# EAGLE board Smoothiepanel (EAGLE 6.3)
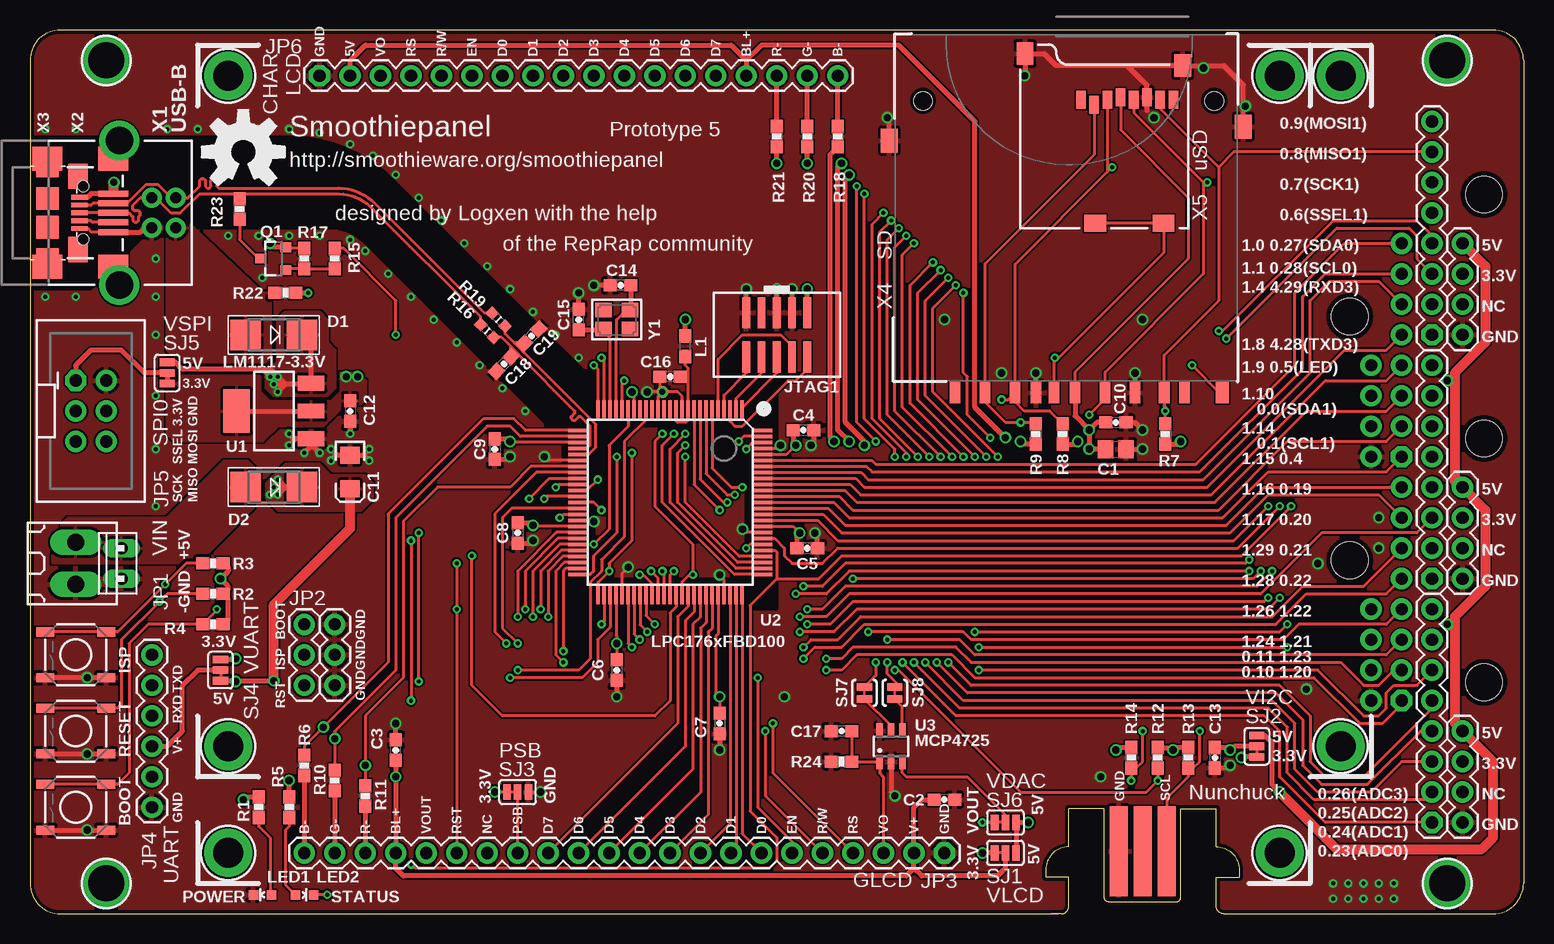
[diagram p2: board, top side]
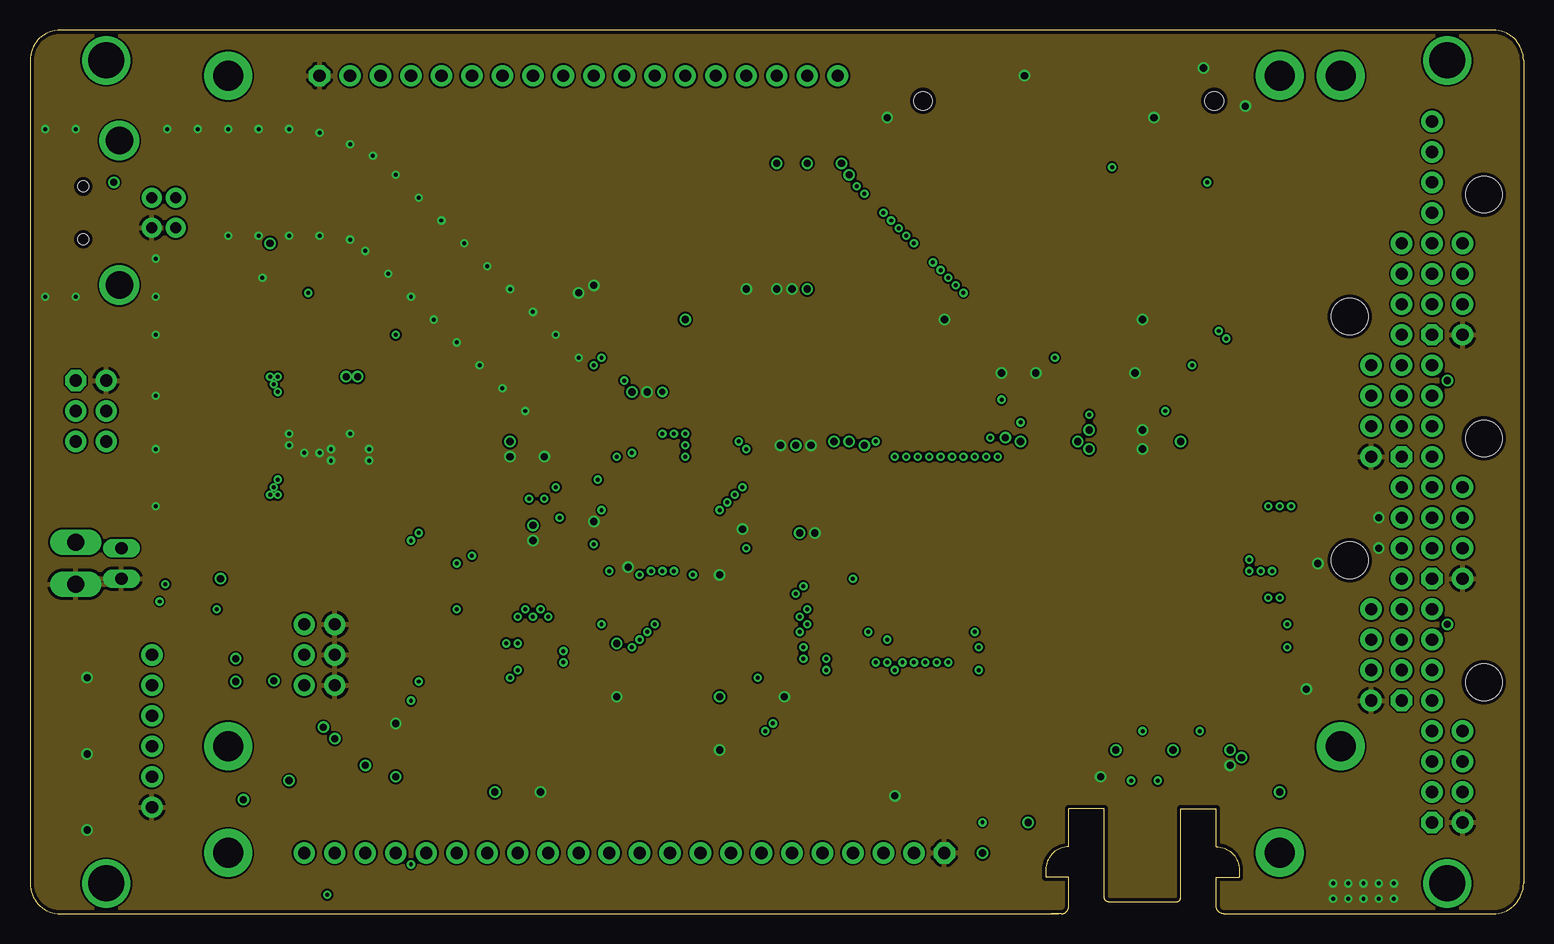
[diagram p3: board, inner layer Route2]
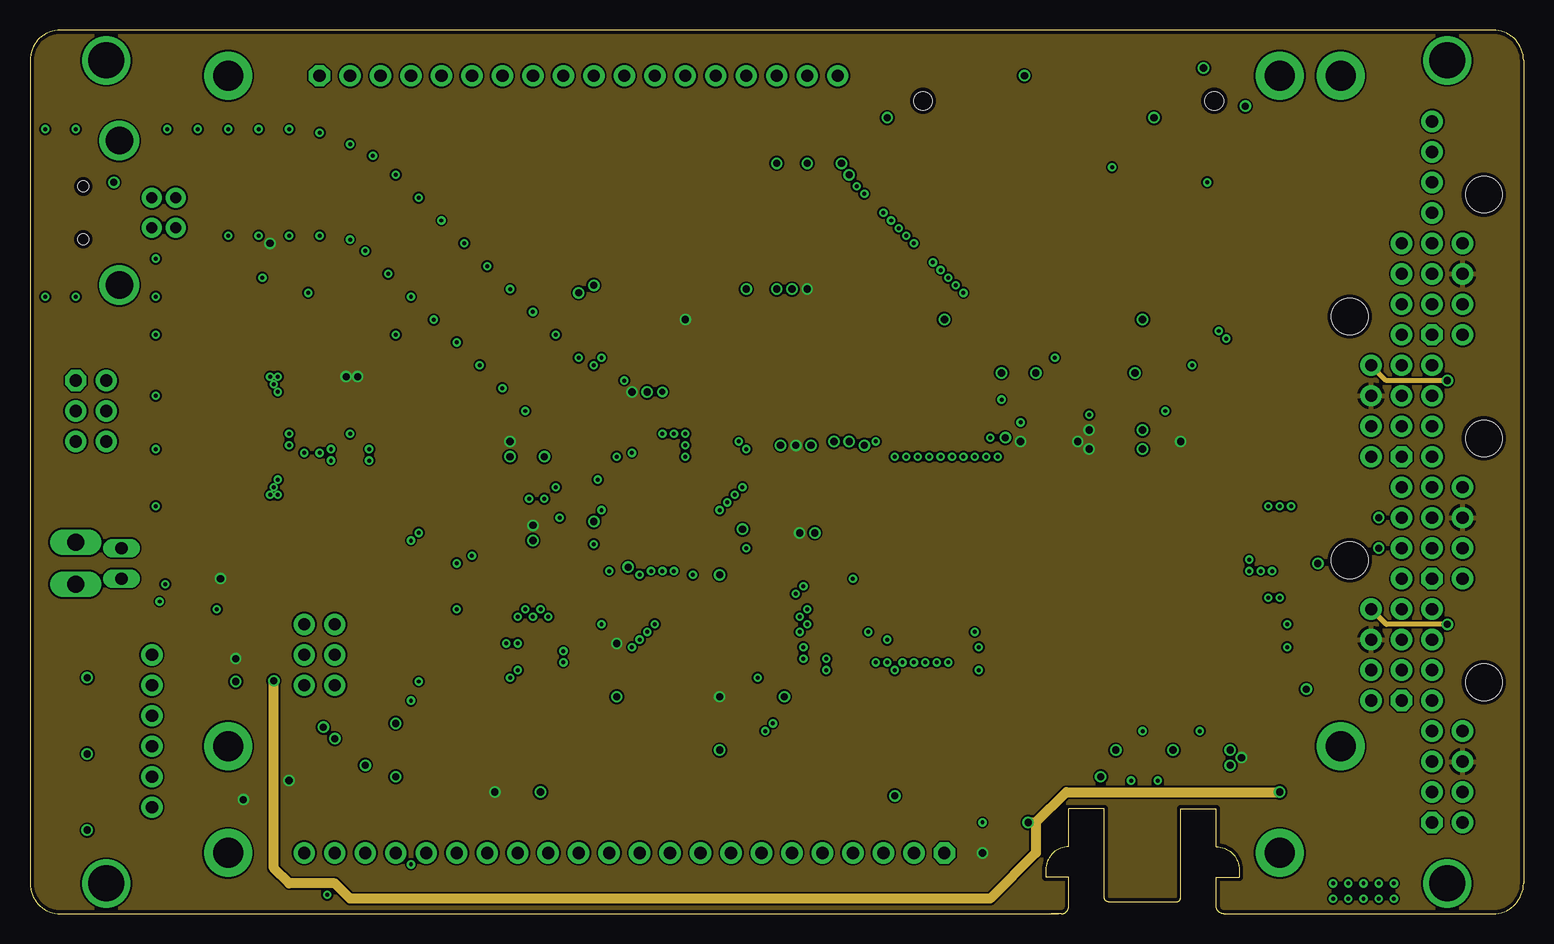
[diagram p4: board, inner layer Route15]
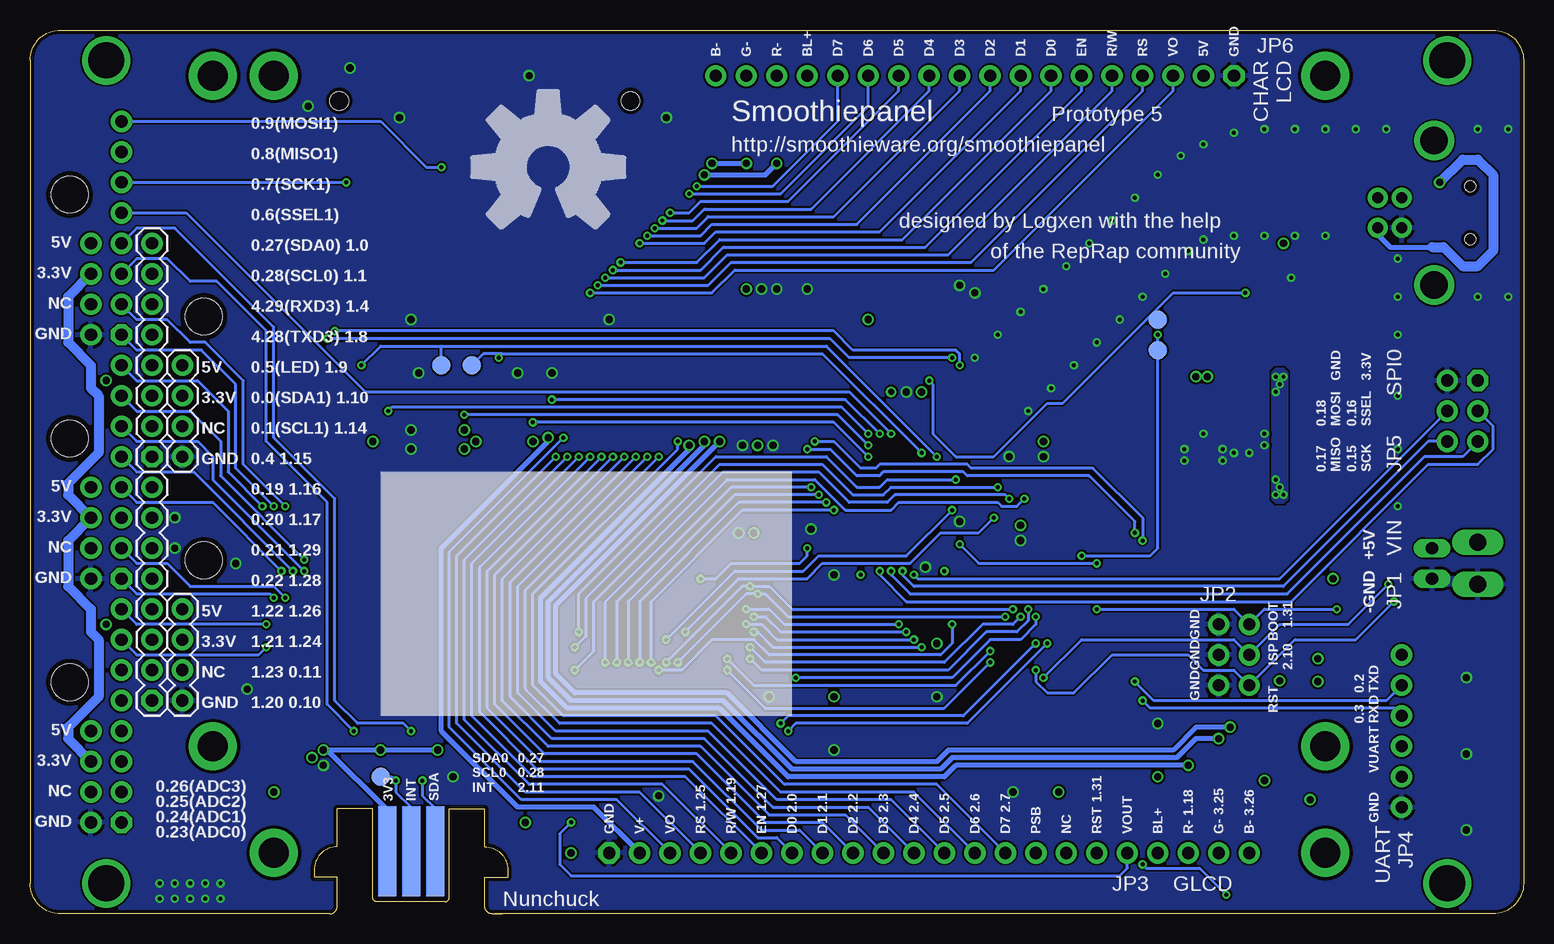
[diagram p5: board, bottom side, seen from below]

Size 124.46 x 73.66 mm. Coordinates in mm from the lower left corner, seen from the top.
Outline: 85.72,0 2.54,0 arc-90 0,2.54 0,71.12 arc-90 2.54,73.66 121.92,73.66 arc-90 124.46,71.12 124.46,2.54 arc-90 121.92,0 99.69,0
Copper layers (1*2*15*16): Top 0.07mm / dielectric 0.2mm / Route2 0.035mm / dielectric 0.99mm / Route15 0.035mm / dielectric 0.2mm / Bottom 0.07mm
Design rules "LaenPCBOrder *": minimum track width 6mil, minimum drill 13mil, track to track 6mil, track to pad 6mil, pad to pad 6mil, via to via 6mil, smd to smd 6mil, copper to edge 12mil, drill to drill 6mil, minimum pad ring 7mil, minimum via ring 7mil, stop-mask expansion 5mil, vias tented up to drill 24mil, thermal gap 10mil

## Footprints (pad centres in the part's own frame; a part is rotated, then mirrored left to right if it is on the bottom)
C0805 = smd 1.3 x 1.5: 1 -0.85,0; 2 0.85,0
0603-CAP = smd 1.1 x 1: 1 -0.85,0; 2 0.85,0
EIA3216 = smd 1.4 x 1.6: A 1.4,0; C -1.4,0
SMADIODE = smd 2.54 x 2.54: A 2.349,0; C -2.349,0
10X02MTA = drill 1.016 long: 1 1.27,0; 2 -1.27,0
1X03 = drill 1.016 pad 1.778: 1 0,0; 2 2.54,0; 3 5.08,0
1X22 = drill 1.016 pad 1.778 octagon: 1 0,0 | drill 1.016 pad 1.778: 2 2.54,0; 3 5.08,0; 4 7.62,0; 5 10.16,0; 6 12.7,0; 7 15.24,0; 8 17.78,0; 9 20.32,0; 10 22.86,0; 11 25.4,0; 12 27.94,0; 13 30.48,0; 14 33.02,0; 15 35.56,0; 16 38.1,0; 17 40.64,0; 18 43.18,0; 19 45.72,0; 20 48.26,0; 21 50.8,0; 22 53.34,0
1X06 = drill 1.016 pad 1.778: 1 0,0; 2 2.54,0; 3 5.08,0; 4 7.62,0; 5 10.16,0; 6 12.7,0
2X3-SHROUDED = drill 1.016 pad 1.778 octagon: 1 -1.27,2.54 | drill 1.016 pad 1.778: 2 1.27,2.54; 3 -1.27,0; 4 1.27,0; 5 -1.27,-2.54; 6 1.27,-2.54
TEXT_LCD = drill 1.016 pad 1.778: A 35.56,0; B 43.18,0; D0 15.24,0; D1 17.78,0; D2 20.32,0; D3 22.86,0; D4 25.4,0; D5 27.94,0; D6 30.48,0; D7 33.02,0; E 12.7,0; G 40.64,0; R 38.1,0; R/W 10.16,0; RS 7.62,0; VDD 2.54,0; VO 5.08,0 | drill 1.016 pad 1.778 octagon: GND 0,0
2X05_1.27MM_SMT = smd 0.65 x 2.6: 1 -2.54,-1.85; 2 -2.54,1.85; 3 -1.27,-1.85; 4 -1.27,1.85; 5 0,-1.85; 6 0,1.85; 7 1.27,-1.85; 8 1.27,1.85; 9 2.54,-1.85; 10 2.54,1.85
0603 = smd 1.1 x 1: 1 -0.85,0; 2 0.85,0
LED-0603 = smd 0.8 x 0.8: A 0,-0.75; C 0,0.75
MOUNTINGHOLE_2.5_PLATED_THICK = drill 2.5 pad 4: P$1 0,0
MOUNTINGHOLE_3.0_PLATEDTHIN = drill 3 pad 3.6: P$1 0,0
NET_LINK = drill 0.5: P$1 0,0 | smd 1.016 x 1.016: P$2 0,0
WII_NUNCHUCK = smd 7.492 x 1.5: 1 5.207,2; 2 5.207,0; 3 5.207,-2 | smd 7.492 x 1.5 bottom: 4 5.207,-2; 5 5.207,0; 6 5.207,2
SOT23-3 = smd 0.8 x 0.9: 1 -0.95,-1; 2 0.95,-1; 3 0,1.1
0603-RES = smd 1.1 x 1: 1 -0.85,0; 2 0.85,0
_0603MP = smd 0.8 x 0.8: 1 -0.762,0; 2 0.762,0
TACTILE_SWITCH_SMD = smd 1.524 x 0.762: 1 -2.54,1.905; 2 2.54,1.905; 3 -2.54,-1.905; 4 2.54,-1.905
SJ_3 = smd 0.635 x 1.27: 1 -0.889,0; 2 0,0; 3 0.889,0
SJ_2S-TRACE = smd 0.635 x 1.27: 1 -0.508,0; 2 0.508,0
TPAD-1.5 = smd 1.524 x 1.524: 1 0,0
SOT223 = smd 1.219 x 2.235: 1 -2.311,-3.099; 2 0,-3.099; 3 2.311,-3.099 | smd 3.6 x 2.2: 4 0,3.099
LQFP100 = smd 0.27 x 1.5: 1 -6,-7.75; 2 -5.5,-7.75; 3 -5,-7.75; 4 -4.5,-7.75; 5 -4,-7.75; 6 -3.5,-7.75; 7 -3,-7.75; 8 -2.5,-7.75; 9 -2,-7.75; 10 -1.5,-7.75; 11 -1,-7.75; 12 -0.5,-7.75; 13 0,-7.75; 14 0.5,-7.75; 15 1,-7.75; 16 1.5,-7.75; 17 2,-7.75; 18 2.5,-7.75; 19 3,-7.75; 20 3.5,-7.75; 21 4,-7.75; 22 4.5,-7.75; 23 5,-7.75; 24 5.5,-7.75; 25 6,-7.75; 51 6,7.75; 52 5.5,7.75; 53 5,7.75; 54 4.5,7.75; 55 4,7.75; 56 3.5,7.75; 57 3,7.75; 58 2.5,7.75; 59 2,7.75; 60 1.5,7.75; 61 1,7.75; 62 0.5,7.75; 63 0,7.75; 64 -0.5,7.75; 65 -1,7.75; 66 -1.5,7.75; 67 -2,7.75; 68 -2.5,7.75; 69 -3,7.75; 70 -3.5,7.75; 71 -4,7.75; 72 -4.5,7.75; 73 -5,7.75; 74 -5.5,7.75; 75 -6,7.75 | smd 1.5 x 0.27: 26 7.75,-6; 27 7.75,-5.5; 28 7.75,-5; 29 7.75,-4.5; 30 7.75,-4; 31 7.75,-3.5; 32 7.75,-3; 33 7.75,-2.5; 34 7.75,-2; 35 7.75,-1.5; 36 7.75,-1; 37 7.75,-0.5; 38 7.75,0; 39 7.75,0.5; 40 7.75,1; 41 7.75,1.5; 42 7.75,2; 43 7.75,2.5; 44 7.75,3; 45 7.75,3.5; 46 7.75,4; 47 7.75,4.5; 48 7.75,5; 49 7.75,5.5; 50 7.75,6; 76 -7.75,6; 77 -7.75,5.5; 78 -7.75,5; 79 -7.75,4.5; 80 -7.75,4; 81 -7.75,3.5; 82 -7.75,3; 83 -7.75,2.5; 84 -7.75,2; 85 -7.75,1.5; 86 -7.75,1; 87 -7.75,0.5; 88 -7.75,0; 89 -7.75,-0.5; 90 -7.75,-1; 91 -7.75,-1.5; 92 -7.75,-2; 93 -7.75,-2.5; 94 -7.75,-3; 95 -7.75,-3.5; 96 -7.75,-4; 97 -7.75,-4.5; 98 -7.75,-5; 99 -7.75,-5.5; 100 -7.75,-6
SOT23-6 = smd 0.55 x 1.2: 1 -0.95,-1.3; 2 0,-1.3; 3 0.95,-1.3; 4 0.95,1.3; 5 0,1.3; 6 -0.95,1.3
PAPILIO-WING-8BITS-F = drill 1.016 pad 1.778 octagon: 1 0,0 | drill 1.016 pad 1.778: 2 0,2.54; 3 0,5.08; 4 0,7.62; 5 0,10.16; 6 0,12.7; 7 0,15.24; 8 0,17.78; 9 2.54,0; 10 2.54,2.54; 11 2.54,5.08; 12 2.54,7.62 | hole 3.048: 4.318,11.684
USB-B-PTH = drill 0.914 pad 1.676: D+ 0,1.25; D- 1.981,1.25; GND 0,-1.25; VBUS 1.981,-1.25 | drill 2.286: S1 -2.718,-6.02; S2 -2.718,6.02
USB-MINIB = smd 2.5 x 0.5: D+ 2.5,0; D- 2.5,0.8; GND 2.5,-1.6; ID 2.5,-0.8; VBUS 2.5,1.6 | smd 2.5 x 2: MTN1 -3,4.5; MTN2 2.5,4.5; MTN3 -3,-4.5; MTN4 2.5,-4.5 | hole 0.9: 0,2.2; 0,-2.2
USB-MICROB-RECEPT = smd 0.4 x 1.35: 1 -1.3,4.125; 2 -0.65,4.125; 3 0,4.125; 4 0.65,4.125; 5 1.3,4.125 | smd 2.1 x 1.6: P$1 3.05,4; P$2 -3.05,4 | smd 1.8 x 1.9: P$3 -3.85,1.45; P$4 3.85,1.45 | smd 1.9 x 1.9: P$5 -1.2,1.45; P$6 1.2,1.45
SDCARD_4UCONN = smd 1.8 x 0.9: 1 -1,6.77; 2 -1,4.27; 3 -1,2.52; 4 -1,-0.73; 5 -1,-3.23; 6 -1,-5.73; 7 -1,-8.15; 8 -1,-9.85; 9 -1,9.27; CD -1,1.02 | smd 2 x 1.4: SH@1 20,14.75; SH@2 21.15,-14.75 | smd 1.8 x 1.1: WP -1,-13 | hole 1.55: 23.3,11.94; 23.3,-12.32
MICRO-SD-SOCKET-PP = smd 0.8 x 1.5: 1 -8.94,10.7; 2 -7.84,10.3; 3 -6.74,10.7; 4 -5.64,10.9; 5 -4.54,10.7; 6 -3.44,10.9; 7 -2.34,10.7; 8 -1.24,10.7 | smd 1.8 x 1.4: CD1 -2.05,0.4; CD2 -7.75,0.4 | smd 1.4 x 1.9: GND1 -13.6,14.55; GND3 -0.45,13.55
CRYSTAL_3.2X2.5 = smd 1.4 x 1.2: 1 -1.1,-0.8; 2 1.1,0.8; GND1 -1.1,0.8; GND2 1.1,-0.8
180-2 = drill 1.422 long: 1 -1.75,0; 2 1.75,0

## Placement (x,y rotation side)
C1  1uF  [C0805]  90.49,38.73 0 top
C2  0.1uF  [0603-CAP]  76.2,9.53 0 top
C3  0.1uF  [0603-CAP]  30.48,13.65 90 top
C4  0.1uF  [0603-CAP]  64.45,40.32 0 top
C5  0.1uF  [0603-CAP]  64.77,30.48 0 top
C6  0.1uF  [0603-CAP]  48.9,20.32 270 top
C7  0.1uF  [0603-CAP]  57.47,15.88 270 top
C8  0.1uF  [0603-CAP]  40.64,31.75 270 top
C9  0.1uF  [0603-CAP]  38.73,38.73 270 top
C10  0.1uF  [0603-CAP]  90.49,40.96 0 top
C11  10uF  [EIA3216]  26.67,36.83 270 top
C12  0.1uF  [0603-CAP]  26.67,41.91 270 top
C13  0.1uF  [0603-CAP]  98.74,13.02 270 top
C14  18pF  [0603-CAP]  49.21,52.39 180 top
C15  18pF  [0603-CAP]  45.72,49.53 90 top
C16  0.1uF  [0603-CAP]  53.34,44.77 180 top
C17  0.1uF  [0603-CAP]  67.63,15.24 180 top
C18  18pF  [0603-CAP]  39.48,45.83 225 top
C19  18pF  [0603-CAP]  41.8,48.15 45 top
D1  MBRA210LT3  [SMADIODE]  20.32,48.26 180 top
D2  MBRA210LT3  [SMADIODE]  20.32,35.56 180 top
JP1  VIN  [10X02MTA]  7.62,29.21 90 top
JP2  SYS  [1X03]  22.86,19.05 90 top
JP3  GLCD  [1X22]  76.2,5.08 180 top
JP4  UART  [1X06]  10.16,8.89 90 top
JP5  SPI0  [2X3-SHROUDED]  5.08,41.91 0 top
JP6  CHAR_LCD  [TEXT_LCD]  24.13,69.85 0 top
JTAG1  JTAG  [2X05_1.27MM_SMT]  62.23,48.26 180 top
L1  FB  [0603]  54.61,47.31 90 top
LED1  POWER  [LED-0603]  19.37,1.59 90 top
LED2  STATUS  [LED-0603]  22.86,1.59 270 top
MH1  MOUNTINGHOLE2.5_THICK  [MOUNTINGHOLE_2.5_PLATED_THICK]  16.51,5.08 0 top
MH2  MOUNTINGHOLE2.5_THICK  [MOUNTINGHOLE_2.5_PLATED_THICK]  104.14,5.08 0 top
MH3  MOUNTINGHOLE2.5_THICK  [MOUNTINGHOLE_2.5_PLATED_THICK]  109.22,13.97 0 top
MH4  MOUNTINGHOLE2.5_THICK  [MOUNTINGHOLE_2.5_PLATED_THICK]  16.51,13.97 0 top
MH5  MOUNTINGHOLE2.5_THICK  [MOUNTINGHOLE_2.5_PLATED_THICK]  109.22,69.85 0 top
MH6  MOUNTINGHOLE2.5_THICK  [MOUNTINGHOLE_2.5_PLATED_THICK]  16.51,69.85 0 top
MH7  MOUNTINGHOLE2.5_THICK  [MOUNTINGHOLE_2.5_PLATED_THICK]  104.14,69.85 0 top
MH8  MOUNTINGHOLE3.0THIN  [MOUNTINGHOLE_3.0_PLATEDTHIN]  118.11,2.54 0 top
MH9  MOUNTINGHOLE3.0THIN  [MOUNTINGHOLE_3.0_PLATEDTHIN]  118.11,71.12 0 top
MH10  MOUNTINGHOLE3.0THIN  [MOUNTINGHOLE_3.0_PLATEDTHIN]  6.35,2.54 0 top
MH11  MOUNTINGHOLE3.0THIN  [MOUNTINGHOLE_3.0_PLATEDTHIN]  6.35,71.12 0 top
N1  NET_LINK  [NET_LINK]  52.7,43.5 90 top
PCB1  WII_NUNCHUCK  [WII_NUNCHUCK]  92.71,0 90 top
Q1  BC857B  [SOT23-3]  20.32,54.61 90 top
R1  330R  [0603-RES]  19.05,8.89 270 top
R2  10K  [0603-RES]  15.24,26.67 0 top
R3  10K  [0603-RES]  15.24,29.21 0 top
R4  10K  [0603-RES]  15.24,24.13 0 top
R5  330R  [0603-RES]  21.59,8.89 270 top
R6  0R  [0603-RES]  22.86,12.38 90 top
R7  10K  [0603-RES]  94.61,40.01 270 top
R8  10K  [0603-RES]  86.04,40.01 270 top
R9  10K  [0603-RES]  83.82,40.01 270 top
R10  0R  [0603-RES]  25.4,11.11 90 top
R11  0R  [0603-RES]  27.94,9.84 90 top
R12  NP  [0603-RES]  93.98,13.02 90 top
R13  10K  [0603-RES]  96.52,13.02 90 top
R14  10K  [0603-RES]  91.76,13.02 90 top
R15  3K  [0603-RES]  25.4,54.61 270 top
R16  33R  [_0603MP]  38.1,48.58 135 top
R17  24K  [0603-RES]  22.86,54.61 90 top
R18  0R  [0603-RES]  67.31,64.77 270 top
R19  33R  [_0603MP]  39.05,49.53 135 top
R20  0R  [0603-RES]  64.77,64.77 270 top
R21  0R  [0603-RES]  62.23,64.77 270 top
R22  100R  [0603-RES]  21.27,51.75 180 top
R23  1.5K  [0603-RES]  17.46,58.74 90 top
R24  NP  [0603-RES]  67.63,12.7 0 top
S1  RESET  [TACTILE_SWITCH_SMD]  3.81,15.24 180 top
S2  ISP  [TACTILE_SWITCH_SMD]  3.81,21.59 180 top
S3  BOOT  [TACTILE_SWITCH_SMD]  3.81,8.89 180 top
SJ1  GLCDV  [SJ_3]  81.28,5.08 180 top
SJ2  VI2C  [SJ_3]  102.23,13.97 270 top
SJ3  PSB  [SJ_3]  40.64,10.16 0 top
SJ4  VUART  [SJ_3]  15.88,20.32 90 top
SJ5  VSPI  [SJ_3]  11.43,45.09 270 top
SJ6  VDAC  [SJ_3]  81.28,7.62 180 top
SJ7  DAC_SCL  [SJ_2S-TRACE]  69.53,18.41 270 top
SJ8  DAC_SDA  [SJ_2S-TRACE]  72.07,18.41 270 top
TP1  TPAD1.5  [TPAD-1.5]  30.48,49.53 0 bottom
TP3  TPAD1.5  [TPAD-1.5]  30.48,46.99 0 bottom
TP4  TPAD1.5  [TPAD-1.5]  95.25,11.43 0 bottom
TP5  TPAD1.5  [TPAD-1.5]  87.63,45.72 0 bottom
TP6  TPAD1.5  [TPAD-1.5]  90.17,45.72 0 bottom
U1  LM1117-3.3V  [SOT223]  20.32,41.91 90 top
U2  LPC176xFBD100  [LQFP100]  53.34,34.29 180 top
U3  MCP4725  [SOT23-6]  71.75,13.97 0 top
U$1  [OSHW-LOGO-HUGE]  81.28,62.23 0 bottom
U$2  [OSHW-LOGO-L]  17.78,63.5 0 top
W1  WING1  [PAPILIO-WING-8BITS-F]  116.84,7.62 0 top
W2  WING2  [PAPILIO-WING-8BITS-F]  116.84,27.94 0 top
W3  WING3  [PAPILIO-WING-8BITS-F]  116.84,48.26 0 top
W4  WING4  [PAPILIO-WING-8BITS-F]  114.3,17.78 0 bottom
W5  WING5  [PAPILIO-WING-8BITS-F]  114.3,38.1 0 bottom
X1  USB-B  [USB-B-PTH]  10.16,58.42 0 top
X2  mUSB  [USB-MINIB]  4.45,58.42 0 top
X3  USB-MICROB-SMDRECEPT  [USB-MICROB-RECEPT]  0,58.42 270 top
X4  SD  [SDCARD_4UCONN]  86.36,44.45 90 top
X5  uSD  [MICRO-SD-SOCKET-PP]  96.52,57.15 0 top
Y1  12MHz  [CRYSTAL_3.2X2.5]  48.9,49.53 0 top
Z1  VIN  [180-2]  3.81,29.21 270 top
Z2  SYS_GND  [1X03]  25.4,19.05 90 top

## Tracks (layer width: path | path; a pad name or v marks a point on that pad's centre or on a via)
3.3V  (via drill 0.6)
  Top 0.254: X5.4 90.88,65.33 96.52,59.69 96.52,54.61 87.09,45.18 X4.4 | R17.2 21.42,55.46 Q1.2 | C7.1 v57.47,18.1 57.15,18.41 57.15,23.18 57.34,23.37 U2.71 | U2.42 42.32,32.29 42.23,32.38 v41.91,32.38 | U2.54 48.84,23.23 48.9,23.18 v48.9,22.54 C6.1 | U2.96 63.05,38.29 v63.82,39.05 | U2.84 63.59,32.29 v64.14,31.75 | U2.19 50.34,43.32 v50.16,43.5 | SJ3.1 v38.73,10.16 | U2.28 40.09,39.29 v40.01,39.37 | C10.1
  Top 0.406: U1.4 U1.2 | C12.1 27.09,42.76 | SJ4.3 17.08,21.21 v17.14,21.27 | L1.2 v54.61,49.53 | JTAG1.1 v64.77,52.07 | R7.2 95.67,39.16 v95.89,39.37 | C1.1 v88.27,38.73 v88.27,40.32 | C10.1 88.9,40.96 v88.27,40.32 | R9.2 82.77,39.16 v82.55,39.37 | R8.2 87.1,39.16 v87.31,39.37 | R1.1 18,9.74 v17.78,9.53 | R5.1 v21.59,11.11 | C8.1 41.7,32.6 v41.91,32.38 | C9.1 39.79,39.59 v40.01,39.37 | C4.1 63.6,39.27 v63.82,39.05 | C5.1 63.92,31.54 v64.14,31.75 | SJ1.3 v79.38,5.08 | X4.4 87.09,41.5 v88.27,40.32 | Q1.2 20.32,55.56 v20,55.88 | R4.2 16.19,24.13 16.51,24.45 16.51,26.25 R2.2 16.19,26.67 16.51,26.99 16.51,27.3 v15.88,27.94 16.51,28.57 16.51,28.89 16.19,29.21 R3.2 | SJ2.3 101.03,13.08 v100.97,13.02
  Bottom 0.813: W3.11 121.28,51.44 121.28,47.62 119.38,45.72 119.38,43.81 118.75,43.18 118.75,38.42 121.28,35.88 121.28,34.92 W2.11 121.28,31.11 121.28,27.3 119.38,25.4 119.38,23.5 118.75,22.86 118.75,18.1 121.28,15.56 121.28,14.61 W1.11
  other vias: 26.35,44.77 27.3,44.77
  pour Top (isolate 0.254, rank 2): 11.43,40.01 11.43,44.45 12.06,45.09 27.3,45.09 27.94,44.45 27.94,42.86 27.3,42.23 26.04,42.23 24.45,40.64 20.64,40.64 19.37,39.37 12.06,39.37
  pour Route15: -5.08,78.74 129.54,78.74 129.54,-5.08 -5.08,-5.08
5V  (via drill 0.33, 0.6)
  Top 0.406: D1.C 23.42,47.51 U1.3 22.95,44.22 22.86,44.13 21.27,44.13 | D2.C 21.27,35.56 | 21.27,35.56 v20.64,36.2 | 21.27,35.56 v20.64,34.92 | 21.27,35.56 v20.32,35.56 | 21.27,44.13 v20.64,44.77 20,45.4 19.37,45.4 | 21.27,44.13 v20.64,43.5 | 21.27,44.13 v20.32,44.13 | SJ4.1 17.08,19.43 | 17.08,19.43 v17.14,19.37 | 17.08,19.43 v20.32,19.43 | SJ1.1 SJ6.1 v83.19,7.62 | 118.75,45.09 v118.11,44.45 118.75,43.81 | 118.75,24.77 v118.11,24.13 118.75,23.5 | v104.14,10.16 103.5,10.79 103.5,14.29 102.93,14.86 SJ2.1 | v20,44.77 19.37,45.4 | 19.37,45.4 12.7,45.4 12.13,45.97 SJ5.1
  Top 0.813: W3.12 121.28,53.98 121.28,47.62 118.75,45.09 118.75,43.81 118.75,36.2 | W2.12 121.28,33.66 121.28,27.3 118.75,24.77 118.75,23.5 118.75,15.88 W1.12 121.92,12.7 121.92,6.35 120.97,5.4 108.9,5.4 v104.14,10.16 | C11.A 26.67,32.13 20.32,25.78 v20.32,19.43
  Top 1.016: 118.75,36.2 W2.12
  Route15 0.406: v118.11,44.45 113.03,44.45 W5.12 | v118.11,24.13 113.03,24.13 W4.12
  Route15 0.813: v83.19,7.62 83.82,7.62 | 83.82,7.62 86.36,10.16 v104.14,10.16 | 83.82,7.62 83.82,5.08 80.01,1.27 26.67,1.27 25.4,2.54 21.59,2.54 20.32,3.81 v20.32,19.43
  Bottom 0.406: 20.32,44.45 v20.32,44.13
  other vias: 20,34.92
  pour Top (isolate 0.254): 21.27,50.16 24.13,50.16 24.77,49.53 24.77,47.62 25.4,46.99 25.4,43.81 24.77,43.18 20.32,43.18 19.68,43.81 19.68,45.09 20.64,46.04 20.64,49.53
  pour Top (isolate 0.254): 20.64,33.66 27.62,33.66 28.57,34.61 28.57,35.88 27.94,36.51 25.08,36.51 24.13,37.47 21.27,37.47 19.68,35.88 19.68,34.61
  pour Bottom (isolate 0.254): 20,45.4 20.64,45.4 20.95,45.09 20.95,34.61 20.64,34.29 20,34.29 19.68,34.61 19.68,45.09
!TRST!
  Top 0.254: U2.4 57.84,43.23 59.69,45.09 JTAG1.10
ADC0  (via drill 0.33)
  Top 0.254: U2.9 55.34,35.78 v57.47,33.66 | W1.1 107.95,7.62 104.14,11.43 104.14,15.24 102.87,16.51 77.15,16.51 v72.71,20.95
  Bottom 0.254: v57.47,33.66 65.09,33.66 72.71,26.04 v72.71,20.95
ADC1  (via drill 0.33)
  Top 0.254: U2.8 55.84,36.23 57.78,34.29 v58.1,34.29 | v73.66,20.95 77.47,17.14 103.19,17.14 104.78,15.56 104.78,11.75 107,9.53 116.2,9.53 W1.2
  Bottom 0.254: v58.1,34.29 65.41,34.29 73.66,26.04 v73.66,20.95
ADC2  (via drill 0.33)
  Top 0.254: U2.7 56.34,36.69 58.1,34.92 v58.74,34.92 | W1.3 114.3,12.7 111.76,10.16 107.31,10.16 105.41,12.06 105.41,15.88 103.5,17.78 77.79,17.78 v74.61,20.95
  Bottom 0.254: v58.74,34.92 65.72,34.92 74.61,26.04 v74.61,20.95
ADC3  (via drill 0.33)
  Top 0.254: U2.6 56.84,37.14 58.42,35.56 v59.37,35.56 | v75.56,20.95 78.11,18.41 103.82,18.41 106.05,16.19 106.05,12.38 107.63,10.79 111.44,10.79 115.89,15.24 W1.4
  Bottom 0.254: v59.37,35.56 66.04,35.56 75.56,26.04 v75.56,20.95
AGND
  Top 0.254: U2.15 52.34,43.13 N1.P$1 | U2.11 54.34,43.13 53.98,43.5 N1.P$1 | C16.2 52.49,43.71 N1.P$1
AVCC
  Top 0.254: 54.84,44.77 U2.10 54.84,41.19 54.61,40.96 53.98,40.96 53.84,41.09 U2.12 | 54.84,44.77 54.84,45.49 54.61,45.72 L1.1 | C16.1 54.84,44.77
DAC_SCL_RES
  Top 0.254: U3.5 71.75,15.68 SJ7.2
DAC_SDA_RES
  Top 0.254: U3.4 72.7,17.27 SJ8.2
DAC_VIN
  Top 0.254: U3.3 72.71,11.75 73.03,11.43 78.11,11.43 81.28,8.26 SJ6.2 79.06,7.62
DM
  Top 0.254: R19.2 37.88,50.07 28.73,59.21 arc44 25.72,60.48 15.72,60.48 15.56,60.64 15.56,61.12 15.4,61.28 15.24,61.28 15.08,61.12 15.08,60.64 14.92,60.48 14.76,60.48 14.61,60.64 14.61,61.12 14.45,61.28 14.29,61.28 14.13,61.12 14.13,60.64 13.16,59.67 X1.D- 11.77,59.67 10.64,60.8 9.68,60.8 8.1,59.22 X2.D- 5.25,59.22 5.08,59.05 4.14,59.05 X3.2
DP
  Top 0.254: R16.2 37.56,49.75 28.57,58.74 arc50 25.4,60.01 17.46,60.01 | 17.46,60.01 14.13,60.01 12.54,58.42 11.75,58.42 10.5,59.67 X1.D+ 9.19,59.67 8.57,59.05 8.57,58.74 8.73,58.58 9.05,58.58 9.21,58.42 9.21,58.26 9.05,58.1 9.05,57.78 8.89,57.63 8.73,57.63 8.57,57.78 8.57,58.1 8.26,58.42 X2.D+ X3.3 | R23.2 17.46,60.01
GND  (via drill 0.33, 0.6)
  Top 0.254: X3.5 4.79,57.12 5.09,56.82 X2.GND | U2.97 62.28,38.79 v62.55,39.05 | U2.72 57.84,27.89 v57.47,28.26 | U2.83 59.65,31.79 v59.37,32.07 | N1.P$2 v51.44,43.5 | U2.41 46.9,32.79 v46.99,32.7 | U2.31 43.17,37.79 v42.86,38.1 | SJ3.3 v42.55,10.16 | U2.55 49.34,28.39 v49.85,28.89
  Top 0.406: U1.1 22,39.6 | 22,39.6 v21.59,40.01 | 22,39.6 22,39.46 v21.59,39.05 | U1.1 23.42,38.98 v22.86,38.42 | U1.1 23.42,39.13 v24.13,38.42 | 25.53,38.23 C11.C 27.81,38.23 | 25.53,38.23 v25.08,37.78 | 25.53,38.23 25.53,38.29 v25.08,38.73 | 27.81,38.23 v28.26,37.78 | 27.81,38.23 27.81,38.29 v28.26,38.73 | C12.2 v26.67,40.01 | X5.GND3 91.44,70.7 | 91.44,70.7 85.51,70.7 84.51,71.7 X5.GND1 82.92,69.9 v82.87,69.85 | 91.44,70.7 93.08,69.06 X5.6 93.08,66.94 | X5.GND3 99.48,70.7 101.11,69.07 X4.SH@2 101.11,67.14 v101.28,67.31 | X2.GND 9.2,56.82 9.53,57.15 10.14,57.15 X1.GND | C7.2 v57.47,13.65 | C6.2 v48.9,18.1 | C15.2 v45.72,51.75 | C14.2 v46.99,52.39 | JTAG1.9 v59.69,52.07 | JTAG1.5 v62.23,52.07 | JTAG1.3 v63.5,52.07 | X4.6 92.09,45.07 v92.08,45.09 | C13.2 99.8,12.17 v100.01,12.38 | C10.2 92.08,40.96 v92.71,40.32 | C1.2 v92.71,38.73 | C8.2 41.7,30.9 v41.91,31.11 | C9.2 39.79,37.88 v40.01,38.1 | C4.2 65.3,39.27 v65.09,39.05 | C5.2 65.62,31.54 v65.41,31.75 | X4.3 83.82,43.47 v83.82,45.09 | X4.SH@1 71.61,66.19 v71.44,66.36 | X5.GND3 97.58,70.7 v97.79,70.48 | C3.2 v30.48,15.88 | U3.2 71.75,10.16 v72.07,9.84 | S1.2 v4.76,13.34 S1.1 | S2.1 v4.76,19.68 S2.2 | S3.2 v4.76,6.99 S3.1
  other vias: 19.05,56.52 21.59,65.41 24.13,56.52 19.05,65.41 16.51,65.41 11.43,65.41 13.97,65.41 10.48,54.61 93.66,66.36 92.71,49.53 80.96,45.09 89.22,11.43 107.31,29.21 106.36,18.73 112.39,30.48 62.87,18.1 24.13,65.09 26.67,64.14 21.59,56.52 26.67,56.2 30.48,61.59 29.84,53.34 34.29,57.78 28.57,63.18 32.38,59.69 27.94,55.24 36.2,55.88 31.75,51.44 38.1,53.98 40.01,52.07 41.91,50.16 43.81,48.26 33.66,49.53 35.56,47.62 39.37,43.81 45.72,46.35 41.27,41.91 37.47,45.72 16.51,56.52 10.48,51.44 10.48,48.26 19.37,53.02 3.81,65.41 1.27,65.41 1.27,51.44 3.81,51.44 109.86,1.27 108.58,1.27 108.58,2.54 109.86,2.54 111.12,2.54 112.39,2.54 113.67,2.54 113.67,1.27 112.39,1.27 111.12,1.27 112.39,33.02 10.48,43.18 10.48,38.73 10.48,33.97 76.2,49.53
  pour Top (rank 6): -2.54,76.2 127,76.2 127,-2.54 -2.54,-2.54
  pour Bottom (rank 6): -1.27,74.93 125.73,74.93 125.73,-1.27 -1.27,-1.27
  pour Route2: -3.81,77.47 128.27,77.47 128.27,-3.81 -3.81,-3.81
INT  (via drill 0.33)
  Top 0.254: U2.52 47.84,24.34 v47.62,24.13 | R12.1 v93.98,11.11 93.03,10.16 82.55,10.16 72.39,20.32 v72.07,20.32
  Bottom 0.254: PCB1.5 92.71,8.89 93.98,10.16 v93.98,11.11 94.3,11.43 TP4.1 | v47.62,24.13 47.62,22.54 48.58,21.59 62.87,21.59 64.14,22.86 67.63,22.86 70.17,20.32 v72.07,20.32
ISP  (via drill 0.33)
  Top 0.254: U2.53 48.34,23.89 47.31,22.86 47.31,20.95 46.04,19.68 v40.01,19.68 | S2.4 S2.3 7.3,23.5 v11.27,27.46 13.02,29.21 R3.1
  Bottom 0.254: v40.01,19.68 36.83,22.86 24.13,22.86 JP2.2 20.32,24.13 14.61,24.13 v11.27,27.46
LCD_D0  (via drill 0.33)
  Top 0.254: U2.75 59.34,6.7 JP3.7 | v77.79,38.1 73.34,42.55 73.34,52.39 v75.25,54.29
  Bottom 0.254: JP3.7 62.23,6.35 63.82,6.35 69.53,12.06 82.23,12.06 87,16.83 87,28.89 v77.79,38.1 | v75.25,54.29 68.9,54.29 66.99,56.2 51.75,56.2 39.37,68.58 JP6.D0
LCD_D1  (via drill 0.33)
  Top 0.254: U2.74 58.84,5.5 JP3.8 | v76.83,38.1 72.71,42.23 72.71,54.93 v73.66,55.88
  Bottom 0.254: JP3.8 60.33,6.99 63.5,6.99 69.22,12.7 81.92,12.7 86.36,17.14 86.36,28.57 v76.83,38.1 | v73.66,55.88 68.26,55.88 67.31,56.83 53.66,56.83 41.91,68.58 JP6.D1
LCD_D2  (via drill 0.33)
  Top 0.254: U2.73 58.34,7.54 JP3.9 | v75.88,38.1 72.07,41.91 72.07,55.56 v73.03,56.52
  Bottom 0.254: JP3.9 58.42,7.62 63.18,7.62 68.9,13.34 81.6,13.34 85.72,17.46 85.72,28.26 v75.88,38.1 | v73.03,56.52 68.58,56.52 67.63,57.47 55.56,57.47 44.45,68.58 JP6.D2
LCD_D3  (via drill 0.33)
  Top 0.254: U2.70 56.84,23.82 56.52,23.5 56.52,8.26 JP3.10 | v74.93,38.1 71.44,41.59 71.44,56.2 v72.39,57.15
  Bottom 0.254: JP3.10 56.52,8.26 62.87,8.26 68.58,13.97 81.28,13.97 85.09,17.78 85.09,27.94 v74.93,38.1 | v72.39,57.15 68.9,57.15 67.94,58.1 57.47,58.1 46.99,68.58 JP6.D3
LCD_D4  (via drill 0.33)
  Top 0.254: U2.69 56.34,24.27 55.88,23.81 55.88,10.16 JP3.11 | v73.98,38.1 70.8,41.27 70.8,56.83 v71.75,57.78
  Bottom 0.254: JP3.11 54.61,8.89 62.55,8.89 68.26,14.61 80.96,14.61 84.45,18.1 84.45,27.62 v73.98,38.1 | v71.75,57.78 69.22,57.78 68.26,58.74 59.37,58.74 49.53,68.58 JP6.D4
LCD_D5  (via drill 0.33)
  Top 0.254: U2.68 55.84,24.73 55.24,24.13 55.24,12.06 JP3.12 | v73.03,38.1 73.03,38.42 70.17,41.27 70.17,57.47 v71.12,58.42
  Bottom 0.254: JP3.12 52.7,9.53 62.23,9.53 67.94,15.24 80.64,15.24 83.82,18.41 83.82,27.3 v73.03,38.1 | v71.12,58.42 69.53,58.42 68.58,59.37 61.28,59.37 52.07,68.58 JP6.D5
LCD_D6  (via drill 0.33)
  Top 0.254: U2.67 55.34,25.18 54.61,24.45 54.61,13.97 JP3.13 | v72.07,38.1 72.07,38.73 69.53,41.27 v69.53,60.01
  Bottom 0.254: JP3.13 50.8,10.16 61.91,10.16 67.63,15.88 80.33,15.88 83.19,18.73 83.19,26.99 v72.07,38.1 | v69.53,60.01 61.91,60.01 54.61,67.31 JP6.D6
LCD_D7  (via drill 0.33)
  Top 0.254: U2.66 54.84,25.63 53.98,24.77 53.98,15.88 JP3.14 | v70.48,39.37 68.9,40.96 v68.9,60.64
  Bottom 0.254: JP3.14 48.9,10.79 61.59,10.79 67.31,16.51 80.01,16.51 82.55,19.05 82.55,26.67 70.48,38.73 v70.48,39.37 | v68.9,60.64 62.55,60.64 57.15,66.04 JP6.D7
LCD_EN  (via drill 0.33)
  Top 0.254: U2.43 43.85,31.79 40.64,28.57 v40.64,24.77 | v60.64,19.68 60.64,8.89 63.5,6.03 JP3.6 | v78.74,38.1 73.98,42.86 73.98,51.75 v75.88,53.66
  Bottom 0.254: v40.64,24.77 40.64,24.13 41.91,22.86 44.45,22.86 47.62,19.68 v60.64,19.68 | JP3.6 69.85,11.43 82.55,11.43 87.63,16.51 87.63,29.21 v78.74,38.1 | v75.88,53.66 68.58,53.66 66.67,55.56 49.85,55.56 36.83,68.58 JP6.E
LCD_LEDB  (via drill 0.6)
  Top 0.254: U2.26 41.31,40.29 40.32,41.27 37.78,41.27 29.84,33.34 29.84,20.95 v24.45,15.56 22.86,13.97 R6.2
  Top 0.406: v66.99,39.37 66.67,39.69 66.67,63.28 R18.2
  Bottom 0.406: v24.45,15.56 27.3,15.56 29.21,13.65 47.94,13.65 48.9,12.7 60.64,12.7 66.36,18.41 79.06,18.41 80.64,20 80.64,25.72 v66.99,39.37
LCD_LEDB_RES
  Top 0.406: R6.1 JP3.22
LCD_LEDB_RES1
  Top 0.406: R18.1 JP6.B
LCD_LEDG  (via drill 0.6)
  Top 0.254: U2.27 40.85,39.79 40.01,40.64 38.1,40.64 30.48,33.02 30.48,20.32 25.4,15.24 v25.4,14.61 R10.2
  Top 0.406: v68.26,39.37 67.31,40.32 67.31,62.23 v67.63,62.55 | v64.77,62.55 R20.2
  Bottom 0.406: v25.4,14.61 27.3,14.61 28.89,13.02 47.62,13.02 48.58,12.06 60.96,12.06 66.67,17.78 79.38,17.78 81.28,19.68 81.28,26.04 68.26,39.05 v68.26,39.37 | v67.63,62.55 v64.77,62.55
LCD_LEDG_RES
  Top 0.406: R10.1 JP3.21
LCD_LEDG_RES1
  Top 0.406: R20.1 JP6.G
LCD_LEDR  (via drill 0.6)
  Top 0.254: U2.32 41.73,37.29 40.01,35.56 33.97,35.56 31.11,32.7 31.11,19.68 27.94,16.51 v27.94,12.38 R11.2
  Top 0.406: v69.53,39.05 69.53,39.37 67.94,40.96 67.94,61.28 v68.26,61.59 | v62.23,62.55 R21.2
  Bottom 0.406: v27.94,12.38 47.31,12.38 48.26,11.43 61.28,11.43 66.99,17.14 79.69,17.14 81.92,19.37 81.92,26.35 69.53,38.73 v69.53,39.05 | v68.26,61.59 63.18,61.59 v62.23,62.55
LCD_LEDR_RES
  Top 0.406: R11.1 JP3.20
LCD_LEDR_RES1
  Top 0.406: R21.1 JP6.R
LCD_PSB
  Top 0.254: JP3.15 SJ3.2 39.69,10.16
LCD_R/W  (via drill 0.33)
  Top 0.254: U2.33 42.19,36.79 38.73,33.34 38.73,23.5 v39.69,22.54 | v61.28,15.24 61.28,9.84 JP3.5 | v79.69,38.1 74.61,43.18 74.61,51.12 v76.52,53.02
  Bottom 0.254: v39.69,22.54 46.35,15.88 60.64,15.88 v61.28,15.24 | JP3.5 71.75,10.79 82.87,10.79 88.27,16.19 88.27,29.53 v79.69,38.1 | v76.52,53.02 68.26,53.02 66.36,54.93 47.94,54.93 34.29,68.58 JP6.R/W
LCD_RS  (via drill 0.33)
  Top 0.254: U2.39 40.14,33.79 39.37,33.02 39.37,23.81 v40.64,22.54 | v61.91,15.88 61.91,11.75 JP3.4 | v80.64,38.1 75.25,43.5 75.25,50.48 v77.15,52.39
  Bottom 0.254: v40.64,22.54 46.67,16.51 61.28,16.51 v61.91,15.88 | JP3.4 73.66,10.16 83.19,10.16 88.9,15.88 88.9,29.84 v80.64,38.1 | v77.15,52.39 67.94,52.39 66.04,54.29 46.04,54.29 31.75,68.58 JP6.RS
LCD_RST  (via drill 0.33)
  Top 0.254: U2.20 49.84,40.63 48.26,39.05 48.26,32.07 v46.99,30.8 | v35.56,29.21 v35.56,25.4 JP3.17 | v15.56,25.4 15.56,25.3 R4.1 9.84,24.13 8.26,22.54 8.26,11.75 7.3,10.79 S3.3 S3.4
  Bottom 0.254: v46.99,30.8 45.4,29.21 v35.56,29.21 | v35.56,25.4 24.13,25.4 JP2.3 21.59,25.4 v15.56,25.4
LCD_V  (via drill 0.6)
  Top 0.254: SJ1.2 80.33,5.08
  Top 0.406: C3.1 v30.48,11.43 JP3.19 30.48,3.81 31.11,3.17 73.03,3.17 73.66,3.81 | C2.1 74.3,9.53 73.66,8.89 JP3.2 73.66,3.81 | SJ1.2 81.28,3.81 80.64,3.17 74.3,3.17 73.66,3.81 | JP6.VDD 26.67,71.12 27.94,72.39 58.42,72.39 59.69,71.12 | 59.69,71.12 JP6.A | v81.28,39.69 78.74,42.23 78.74,66.04 72.39,72.39 60.96,72.39 59.69,71.12
  Bottom 0.406: JP3.2 77.47,8.89 83.82,8.89 90.17,15.24 90.17,30.48 81.28,39.37 v81.28,39.69
LCD_VO  (via drill 0.33)
  Top 0.254: C17.1 R24.2 70.78,12.7 U3.1 70.81,11.74 71.12,11.43 JP3.3 | v80.01,39.69 78.11,41.59 78.11,44.77 77.79,45.09 v77.79,51.75
  Bottom 0.254: JP3.3 75.56,9.53 83.5,9.53 89.53,15.56 89.53,30.16 v80.01,39.69 | v77.79,51.75 67.63,51.75 65.72,53.66 44.13,53.66 29.21,68.58 JP6.VO
LCD_VOUT  (via drill 0.33)
  Top 0.254: v79.38,7.62 SJ6.3
  Bottom 0.254: v79.38,7.62 80.33,6.67 80.33,4.13 79.38,3.17 33.66,3.17 33.02,3.81 JP3.18
LED1_R
  Top 0.254: R1.2 19.05,7.3 20,6.35 20,1.7 LED1.A
LED2_R
  Top 0.254: R5.2 21.59,7.3 21.27,6.99 21.27,2.42 LED2.A
MCU_KEEPOUT
  cutout Top: 44.45,43.18 62.23,43.18 62.23,25.4 44.45,25.4 44.45,40.64 46.99,40.64 46.99,27.94 59.69,27.94 59.69,40.64 44.45,40.64
MISO0  (via drill 0.33)
  Top 0.254: U2.61 52.34,27.99 v51.75,28.57
  Bottom 0.254: JP5.6 7.94,39.37 20,27.3 50.8,27.3 51.75,28.26 v51.75,28.57
MISO1  (via drill 0.33)
  Top 0.254: X5.7 94.18,67.11 99.06,62.23 | 99.06,62.23 99.06,51.12 94.51,46.57 X4.7 94.51,42.33 94.61,42.23 v94.61,41.91 R7.1 | U2.77 58.84,28.79 53.34,34.29 53.34,38.73 v54.61,40.01 | W3.7 100.33,63.5 99.06,62.23
  Bottom 0.254: v54.61,40.01 56.83,42.23 94.3,42.23 v94.61,41.91
MOSI0  (via drill 0.33)
  Top 0.254: U2.60 51.84,27.54 51.12,28.26 v50.8,28.26
  Bottom 0.254: v50.8,28.26 50.48,27.94 20.32,27.94 JP5.4
MOSI1  (via drill 0.33)
  Top 0.254: X5.3 89.78,61.84 | 89.78,61.84 82.09,54.15 X4.2 | U2.76 58.7,28.29 52.7,34.29 52.7,39.05 v53.66,40.01 | v80.96,42.86 81.5,42.86 X4.2 | v90.17,62.23 89.78,61.84 | R8.1 84.99,41.91 82.87,41.91 82.09,42.69 X4.2
  Bottom 0.254: v53.66,40.01 56.52,42.86 v80.96,42.86 | W3.8 95.25,66.04 91.44,62.23 v90.17,62.23
P0_4  (via drill 0.33)
  Top 0.254: v102.55,28.57 101.92,27.94 v68.58,27.94 | U2.81 60,30.79 v59.69,30.48
  Bottom 0.254: W2.5 115.57,36.83 110.81,36.83 v102.55,28.57 | v68.58,27.94 67.31,27.94 66.04,29.21 60.33,29.21 59.69,29.84 v59.69,30.48
P0_5  (via drill 0.33)
  Top 0.254: U2.80 62.1,30.29 62.23,30.16 62.23,27.94 | 62.23,27.94 65.72,27.94 67.63,29.84 100.97,29.84 v105.09,33.97 | 62.23,27.94 60.01,25.72 60.01,8.57 62.23,6.35 62.23,4.45 61.59,3.81 32.07,3.81 v31.75,4.13 | v24.77,1.59 LED2.C
  Bottom 0.254: W2.8 115.57,44.45 110.49,44.45 107.95,41.91 107.95,36.83 v105.09,33.97 | v31.75,4.13 31.43,3.81 26.99,3.81 v24.77,1.59
P0_19  (via drill 0.33)
  Top 0.254: U2.59 51.34,24.86 v52.07,24.13 | v103.5,28.57 102.23,27.3 67.94,27.3 66.04,25.4 v64.77,25.4
  Bottom 0.254: W2.4 115.57,34.29 109.22,34.29 v103.5,28.57 | v64.77,25.4 62.87,25.4 61.59,24.13 v52.07,24.13
P0_20  (via drill 0.33)
  Top 0.254: U2.58 50.84,24.09 v51.44,23.5 | W2.3 115.57,31.75 107.63,31.75 102.55,26.67 68.26,26.67 66.36,24.77 v64.14,24.77
  Bottom 0.254: v64.14,24.77 63.18,24.77 61.91,23.5 v51.44,23.5
P0_21  (via drill 0.33)
  Top 0.254: U2.57 50.34,23.32 v50.8,22.86 | v103.19,26.35 102.87,26.04 68.58,26.04 66.67,24.13 v64.77,24.13
  Bottom 0.254: W2.2 115.57,29.21 113.03,29.21 111.12,27.3 104.14,27.3 v103.19,26.35 | v64.77,24.13 63.5,24.13 62.23,22.86 v50.8,22.86
P0_22  (via drill 0.33)
  Top 0.254: U2.56 49.84,22.55 v50.16,22.23 | v104.14,26.35 103.19,25.4 68.9,25.4 66.99,23.5 v64.14,23.5
  Bottom 0.254: W2.1 115.57,26.67 104.46,26.67 v104.14,26.35 | v64.14,23.5 63.82,23.5 62.55,22.23 v50.16,22.23
P1_0
  Top 0.254: U2.95 70.16,37.79 70.48,37.47 97.16,37.47 105.41,45.72 105.41,51.75 109.54,55.88 W5.8
P1_1
  Top 0.254: U2.94 69.71,37.29 70.17,36.83 97.47,36.83 106.05,45.4 106.05,51.44 107.95,53.34 W5.7
P1_4
  Top 0.254: U2.93 69.25,36.79 69.85,36.2 97.79,36.2 106.68,45.09 106.68,51.12 108.27,52.7 112.39,52.7 W5.6
P1_8
  Top 0.254: U2.92 68.8,36.29 69.53,35.56 98.11,35.56 109.54,46.99 113.03,46.99 W5.5
P1_9
  Top 0.254: U2.91 68.35,35.79 69.22,34.92 98.42,34.92 107.95,44.45 113.03,44.45 W5.4
P1_10
  Top 0.254: U2.90 67.9,35.29 68.9,34.29 98.74,34.29 106.36,41.91 113.03,41.91 W5.3
P1_14
  Top 0.254: U2.89 67.44,34.79 68.58,33.66 99.06,33.66 104.78,39.37 113.03,39.37 W5.2
P1_15
  Top 0.254: U2.88 66.99,34.29 68.26,33.02 99.38,33.02 103.19,36.83 113.03,36.83 W5.1
P1_16
  Top 0.254: U2.87 66.54,33.79 67.94,32.38 99.69,32.38 102.87,35.56 W4.8
P1_17
  Top 0.254: U2.86 66.09,33.29 67.63,31.75 100.01,31.75 103.19,34.92 112.39,34.92 W4.7
P1_21  (via drill 0.33)
  Top 0.254: v43.81,35.56 44.05,35.79 U2.35 | v79.06,22.23 v104.78,22.23
  Bottom 0.254: W1.7 115.57,21.59 105.41,21.59 v104.78,22.23 | v79.06,22.23 78.11,23.18 78.11,26.35 66.99,37.47 58.42,37.47 55.88,34.92 53.34,34.92 52.7,35.56 v43.81,35.56
P1_22  (via drill 0.33)
  Top 0.254: v47.31,36.2 46.4,35.29 U2.36 | v78.74,23.5 104.14,23.5 v104.78,24.13
  Bottom 0.254: W1.8 115.57,24.13 v104.78,24.13 | v78.74,23.5 78.74,26.67 67.31,38.1 58.1,38.1 55.56,35.56 53.66,35.56 53.02,36.2 v47.31,36.2
PCAP0  (via drill 0.33)
  Top 0.254: U2.44 43.99,31.29 41.27,28.57 v41.27,25.4 | v64.45,21.27 65.41,22.23 67.63,22.23 69.53,24.13 103.82,24.13 106.36,26.67 113.03,26.67 W4.5
  Bottom 0.254: v41.27,25.4 41.27,24.45 42.23,23.5 44.77,23.5 47.94,20.32 63.5,20.32 v64.45,21.27
PCAP1  (via drill 0.33)
  Top 0.254: U2.45 44.12,30.79 41.91,28.57 v41.91,24.77 | v64.45,22.23 65.09,22.86 67.31,22.86 69.22,24.77 103.5,24.77 106.05,27.3 111.12,27.3 W4.6
  Bottom 0.254: v41.91,24.77 42.55,24.13 45.09,24.13 48.26,20.95 63.18,20.95 v64.45,22.23
PHA  (via drill 0.33)
  Top 0.254: v76.52,20.95 78.42,19.05 104.14,19.05 106.68,16.51 106.68,12.7 107.95,11.43 111.12,11.43 116.84,17.14 W1.5 | v41.59,34.61 43.27,36.29 U2.34
  Bottom 0.254: v76.52,20.95 76.52,26.04 66.36,36.2 59.05,36.2 56.52,33.66 52.7,33.66 52.07,34.29 43.81,34.29 43.5,33.97 42.23,33.97 v41.59,34.61
PHB  (via drill 0.33)
  Top 0.254: v79.06,20.32 107.31,20.32 111.12,16.51 112.39,16.51 113.03,17.14 113.03,18.41 113.67,19.05 115.57,19.05 W1.6 | U2.37 43.05,34.79 v42.86,34.61
  Bottom 0.254: v79.06,20.32 77.47,21.91 77.47,26.04 66.67,36.83 58.74,36.83 56.2,34.29 53.02,34.29 52.39,34.92 43.18,34.92 v42.86,34.61
PWM5  (via drill 0.33)
  Top 0.254: v71.44,22.86 77.47,22.86 78.74,21.59 113.03,21.59 W4.3 | v47.62,33.66 46.99,34.29 U2.38
  Bottom 0.254: v71.44,22.86 65.72,28.57 60.01,28.57 58.74,29.84 51.44,29.84 v47.62,33.66
PWM6  (via drill 0.33)
  Top 0.254: W4.4 113.03,24.13 105.73,24.13 104.46,22.86 78.42,22.86 77.79,23.5 v69.85,23.5 | v44.13,33.02 44.4,33.29 U2.40
  Bottom 0.254: v69.85,23.5 65.41,27.94 59.69,27.94 58.42,29.21 51.12,29.21 48.58,31.75 45.4,31.75 v44.13,33.02
RESET  (via drill 0.33)
  Top 0.254: U2.17 51.34,41.18 49.53,39.37 49.53,31.43 47.62,29.53 47.62,28.57 46.67,27.62 46.67,21.27 45.72,20.32 v40.64,20.32 | S1.4 S1.3 7.3,17.14 7.62,17.46 7.62,22.86 v10.79,26.04 11.43,26.67 R2.1
  Bottom 0.254: v40.64,20.32 40.64,19.37 39.69,18.41 37.47,18.41 34.29,21.59 27.94,21.59 26.67,20.32 24.13,20.32 JP2.1 19.05,22.86 13.97,22.86 v10.79,26.04
RXD0  (via drill 0.33)
  Top 0.254: U2.99 59.48,39.79 v59.05,39.37 | v31.75,31.11 v31.75,17.78
  Bottom 0.254: JP4.4 10.79,17.14 31.11,17.14 v31.75,17.78 | v59.05,39.37 57.47,39.37 55.24,37.15 53.98,37.15 53.66,37.47 46.35,37.47 46.04,37.15 35.88,37.15 31.75,33.02 v31.75,31.11
RXD2  (via drill 0.33)
  Top 0.254: U2.49 44.66,28.79 44.45,28.57 v44.45,21.91 | W4.2 113.67,20.32 112.39,19.05 111.12,19.05 109.22,20.95 78.42,20.95 77.15,22.23 68.58,22.23 67.63,21.27 v66.36,21.27
  Bottom 0.254: v66.36,21.27 64.14,19.05 47.31,19.05 v44.45,21.91
RXD3  (via drill 0.33)
  Top 0.254: U2.85 65.64,32.79 67.31,31.11 100.33,31.11 v103.19,33.97
  Bottom 0.254: v103.19,33.97 106.68,37.47 106.68,44.45 109.86,47.62 111.12,47.62 113.03,49.53 115.57,49.53 W3.2
SCK0  (via drill 0.33)
  Top 0.254: U2.62 52.84,28.44 v52.7,28.57
  Bottom 0.254: JP5.5 5.08,38.1 8.26,38.1 19.68,26.67 51.12,26.67 52.7,28.26 v52.7,28.57
SCK1  (via drill 0.33)
  Top 0.254: X5.5 91.98,66.77 97.79,60.96 | 97.79,60.96 97.79,53.34 89.59,45.14 X4.5 89.59,42.92 v88.27,41.59 | U2.78 58.98,29.29 53.98,34.29 53.98,38.42 v54.61,39.05 | v98.11,60.96 97.79,60.96
  Bottom 0.254: v54.61,39.05 57.15,41.59 v88.27,41.59 | W3.6 v98.11,60.96
SCL0  (via drill 0.33)
  Top 0.254: PCB1.3 94.71,9.62 96.52,11.43 R13.1 96.94,12.17 97.47,12.7 v97.47,15.24 | U2.24 47.84,46.14 v47.62,46.35 | v99.69,47.94 108.9,57.15 114.94,57.15 115.57,56.52 115.57,54.61 W3.3
  Bottom 0.254: W3.3 115.57,54.61 113.03,54.61 111.12,52.7 108.9,52.7 104.78,48.58 104.78,39.37 99.69,34.29 99.69,17.46 v97.47,15.24 | v47.62,46.35 56.2,46.35 57.78,47.94 v99.69,47.94
SCL1  (via drill 0.33)
  Top 0.254: U2.47 44.4,29.79 43.18,28.57 v43.18,24.77 | v101.6,28.57 68.26,28.57 66.36,26.67 v63.82,26.67 | v70.48,20.95 70.48,19.88 SJ7.1
  Bottom 0.254: W2.6 115.57,39.37 110.49,39.37 109.22,38.1 109.22,36.2 v101.6,28.57 | v43.18,24.77 61.28,24.77 63.18,26.67 v63.82,26.67 64.77,26.67 v70.48,20.95
SD_CD  (via drill 0.33)
  Top 0.254: 85.34,45.97 94.47,55.1 X5.CD1 X5.CD2 | 85.34,45.97 X4.CD 85.34,43.88 | U2.51 47.34,27.66 v48.26,28.57 48.26,29.21 50.16,31.11 v50.16,38.42 | 85.34,45.97 85.34,46.29 v85.41,46.35
  Bottom 0.254: v85.41,46.35 85.09,46.67 | 85.09,46.67 58.42,46.67 v50.16,38.42 | 85.09,46.67 86.68,46.67 TP5.1
SD_WP  (via drill 0.33)
  Top 0.254: X4.WP 99.11,43.45 v96.84,45.72 | U2.50 46.7,28.29 46.99,28.57 46.99,29.84 48.9,31.75 v48.9,38.1
  Bottom 0.254: v96.84,45.72 95.25,47.31 90.17,47.31 | 90.17,47.31 58.1,47.31 v48.9,38.1 | TP6.1 90.17,47.31
SDA0  (via drill 0.33)
  Top 0.254: v91.76,11.11 R14.1 92.18,12.17 92.71,12.7 v92.71,15.24 | U2.25 47.34,45.37 v46.99,45.72 | v99.06,48.58 99.38,48.58 108.58,57.78 115.57,57.78 116.84,56.52 W3.4
  Bottom 0.254: v91.76,11.11 91.76,9.84 90.71,8.79 PCB1.6 | W3.4 115.57,57.15 112.39,57.15 104.14,48.9 104.14,39.69 99.06,34.61 99.06,17.78 97.16,15.88 93.34,15.88 v92.71,15.24 | v46.99,45.72 46.99,46.67 47.31,46.99 55.88,46.99 57.47,48.58 v99.06,48.58
SDA1  (via drill 0.33)
  Top 0.254: U2.46 44.26,30.29 42.55,28.57 v42.55,25.4 | v101.6,29.53 101.28,29.21 67.94,29.21 66.04,27.3 v64.45,27.3 | SJ8.1 72.52,18.92 71.44,20 v71.44,20.95
  Bottom 0.254: W2.7 115.57,41.91 111.12,41.91 108.58,39.37 108.58,36.51 v101.6,29.53 | v42.55,25.4 60.96,25.4 62.87,27.3 v64.45,27.3 65.09,27.3 v71.44,20.95
SSEL0  (via drill 0.33)
  Top 0.254: U2.63 53.34,28.26 v53.66,28.57
  Bottom 0.254: v53.66,28.57 53.66,28.26 51.44,26.04 19.37,26.04 7.94,37.47 3.81,37.47 2.54,38.73 2.54,40.64 JP5.3
SSEL1  (via drill 0.33)
  Top 0.254: X4.1 79.59,54.19 88.68,63.28 X5.2 | X4.1 79.59,43.92 | U2.79 59.11,29.79 54.61,34.29 v54.61,38.1 | R9.1 83.72,40.96 v82.55,40.96 81.28,40.96 79.59,42.65 X4.1
  Bottom 0.254: v54.61,38.1 57.47,40.96 v82.55,40.96
SSEL1_A  (via drill 0.33)
  Top 0.254: U2.65 54.34,27.67 54.93,28.26 v55.24,28.26 55.24,30.8 52.07,33.97 52.07,39.37 v52.7,40.01
  Bottom 0.254: W3.5 111.44,58.42 96.52,43.5 56.2,43.5 v52.7,40.01
TCK
  Top 0.254: U2.5 57.34,46.23 59.37,48.26 62.55,48.26 63.5,47.31 JTAG1.4
TDI
  Top 0.254: U2.2 58.84,42.97 60.96,45.09 JTAG1.8
TDO
  Top 0.254: U2.1 59.34,42.2 62.23,45.09 JTAG1.6
TMS
  Top 0.254: U2.3 58.34,41.04 58.74,40.64 59.37,40.64 63.18,44.45 63.82,44.45 64.77,45.4 JTAG1.2
TXD0  (via drill 0.33)
  Top 0.254: U2.98 60.24,39.29 v59.69,38.73 | v32.38,19.37 v32.38,31.75
  Bottom 0.254: JP4.5 11.43,17.78 30.8,17.78 v32.38,19.37 | v59.69,38.73 57.78,38.73 55.56,36.51 53.66,36.51 53.34,36.83 46.67,36.83 46.35,36.51 36.2,36.51 32.38,32.7 v32.38,31.75
TXD2  (via drill 0.33)
  Top 0.254: U2.48 44.53,29.29 43.81,28.57 43.81,21.59 v44.45,20.95 | W4.1 114.3,17.46 112.71,15.88 110.81,15.88 107,19.68 78.74,19.68 76.83,21.59 68.9,21.59 67.63,20.32 v66.36,20.32
  Bottom 0.254: v66.36,20.32 63.18,17.14 48.26,17.14 v44.45,20.95
TXD3  (via drill 0.33)
  Top 0.254: U2.82 62.05,31.29 62.87,30.48 62.87,29.84 63.5,29.21 66.04,29.21 67.31,30.48 100.65,30.48 v104.14,33.97
  Bottom 0.254: v104.14,33.97 107.31,37.15 107.31,44.13 110.17,46.99 115.57,46.99 W3.1
USB_CONNECT  (via drill 0.33)
  Top 0.254: U2.64 53.84,25.58 53.34,25.08 53.34,17.78 52.07,16.51 39.37,16.51 36.83,19.05 v36.83,29.84 | v30.48,48.26 30.48,51.12 26.14,55.46 R15.1
  Bottom 0.254: v36.83,29.84 31.11,29.84 30.48,30.48 TP3.1 v30.48,48.26
USB_CONNECT_BASE
  Top 0.254: Q1.1 21.42,53.76 R17.1 R15.2
USB_CONNECT_COLLECTOR
  Top 0.254: 19.22,54.86 Q1.3 19.05,54.61 17.46,56.2 R23.1
USB_DM
  Top 0.254: U2.30 46.55,38.29 47.15,38.89 47.15,40.8 41.07,46.87 41.05,46.87 40.33,47.59 | 40.33,47.59 39.59,48.33 R19.1 | C19.1 41.16,47.59 40.33,47.59
USB_DP
  Top 0.254: U2.29 46.41,38.79 46.67,39.05 46.67,40.64 45.88,41.43 45.72,41.43 45.4,41.12 45.24,41.12 45.09,41.27 45.09,41.43 45.4,41.75 45.4,41.91 40.76,46.56 40.76,46.58 40.04,47.3 | C18.1 40.04,46.47 40.04,47.3 | 40.04,47.3 39.3,48.04 R16.1
USB_ID
  Top 0.254: X2.ID 5.25,57.62 5.08,57.78 4.14,57.78 X3.4
USB_KEEPOUT
  cutout Top: -6.35,64.77 22.23,64.77 arc-44 30.48,60.96 48.26,43.18 48.26,39.37 46.99,38.1 45.72,38.1 27.94,55.88 arc37 25.4,57.15 13.97,57.15 12.7,58.42 11.43,58.42 5.08,52.07 -6.35,52.07
USB_VBUS  (via drill 0.33)
  Top 0.254: U2.21 49.34,44.26 v49.53,44.45
  Top 0.406: R22.1 v23.18,51.75
  Bottom 0.254: v49.53,44.45 49.21,44.13 49.21,40.01 47.31,38.1 44.13,38.1 39.69,42.55 38.42,42.55 30.96,50.01 | 30.96,50.01 29.21,51.75 v23.18,51.75 | TP1.1 30.96,49.53 30.96,50.01
VBUS  (via drill 0.6)
  Top 0.406: X3.1 4.79,59.72 5.09,60.02 X2.VBUS 6.99,60.06 6.99,60.17
  Top 0.813: 6.99,60.17 v6.99,60.96
  Bottom 0.406: X1.VBUS 12.14,56.59 11.11,55.56 7.62,55.56
  Bottom 0.813: v6.99,60.96 5.08,62.87 3.81,62.87 2.54,61.59 2.54,55.24 3.81,53.98 5.08,53.98 6.67,55.56 7.62,55.56
  pour Top (isolate 0.254): 11.43,59.05 13.97,59.05 13.97,56.83 19.05,52.07 19.37,51.75 20,51.75 20,46.35 19.37,45.72 12.7,45.72 11.43,46.99
VI2C  (via drill 0.6)
  Top 0.254: SJ2.2 102.23,13.34
  Top 0.406: C13.1 99.8,13.87 v100.01,13.65 100.33,13.97 SJ2.2 | R12.2 95.03,13.87 v95.25,13.65 95.47,13.87 R13.2 | R14.2 90.7,13.87 v90.49,13.65
  Bottom 0.406: 99.69,13.65 94.71,8.67 PCB1.4 | v90.49,13.65 v95.25,13.65 99.69,13.65 | 99.69,13.65 v100.01,13.65
VIN
  pour Top (isolate 0.254): 1.91,29.21 1.91,31.75 3.17,33.02 11.43,33.02 16.19,37.78 18.1,37.78 19.05,36.83 19.05,34.29 13.97,29.21
VSPI
  Top 0.406: JP5.1 3.81,45.72 5.08,46.99 7.62,46.99 9.53,45.09 SJ5.2 11.43,44.13
VUART
  Top 0.254: SJ4.2 15.88,19.37
  Top 0.406: JP4.3 11.43,13.97 12.7,15.24 12.7,19.05 13.97,20.32 SJ4.2
  Bottom 0.406: 10.79,13.97 JP4.3
XTAL1
  Top 0.254: U2.22 48.84,47.89 48.9,47.94 48.9,49.53 49.7,50.33 Y1.2
  Top 0.406: C14.1 50.06,50.4 Y1.2
XTAL2
  Top 0.254: U2.23 48.34,47.86 48.26,47.94 48.26,48.27 Y1.1
  Top 0.406: C15.1 47.74,48.68 Y1.1

## Text on the board
tPlace: CHAR / LCD | GND | 5V | VO | RS | R/W | EN | D0 | D1 | D2 | D3 | D4 | D5 | D6 | D7 | BL+ | R- | G- | B- | Smoothiepanel | Prototype 5 | 0.9(MOSI1) | 0.8(MISO1) | http://smoothieware.org/smoothiepanel | 0.7(SCK1) | designed by Logxen with the help | 0.6(SSEL1) | of the RepRap community | 1.0 0.27(SDA0) | 5V | 1.1 0.28(SCL0) | 3.3V | 1.4 4.29(RXD3) | NC | VSPI | GND | 1.8 4.28(TXD3) | 5V | 1.9 0.5(LED) | 3.3V | 1.10 | 0.0(SDA1) | 3.3V | GND | 1.14 | 0.1(SCL1) | SSEL | MOSI | 1.15 0.4 | 1.16 0.19 | 5V | SCK | MISO | 1.17 0.20 | 3.3V | +5V | 1.29 0.21 | NC | 1.28 0.22 | GND | -GND | 1.26 1.22 | BOOT | GND | 3.3V | 1.24 1.21 | 0.11 1.23 | VUART | ISP | GND | 0.10 1.20 | TXD | GND | 5V | RST | VI2C | RXD | 5V | 5V | V+ | PSB | 3.3V | 3.3V | VDAC | Nunchuck | 0.26(ADC3) | NC | 3.3V | GND | GND | 5V | 0.25(ADC2) | B- | G- | R- | BL+ | VOUT | RST | NC | PSB | D7 | D6 | D5 | D4 | D3 | D2 | D1 | D0 | EN | R/W | RS | VO | V+ | GND | VOUT | GND | 0.24(ADC1) | 0.23(ADC0) | 5V | 3.3V | POWER | STATUS | VLCD
bPlace: JP6 | CHAR / LCD | GND | 5V | VO | RS | R/W | EN | D0 | D1 | D2 | D3 | D4 | D5 | D6 | D7 | BL+ | R- | G- | B- | Prototype 5 | Smoothiepanel | 0.9(MOSI1) | http://smoothieware.org/smoothiepanel | 0.8(MISO1) | 0.7(SCK1) | 0.6(SSEL1) | designed by Logxen with the help | 5V | of the RepRap community | 0.27(SDA0) 1.0 | 3.3V | 0.28(SCL0) 1.1 | NC | 4.29(RXD3) 1.4 | GND | 4.28(TXD3) 1.8 | 0.5(LED) 1.9 | 5V | 3.3V | GND | SPI0 | 0.0(SDA1) 1.10 | 3.3V | 0.16 / SSEL | 0.18 / MOSI | 0.1(SCL1) 1.14 | NC | JP5 | 0.15 / SCK | 0.17 / MISO | 0.4 1.15 | GND | 5V | 0.19 1.16 | 3.3V | 0.20 1.17 | NC | VIN | +5V | 0.21 1.29 | GND | 0.22 1.28 | BOOT / 1.31 | JP2 | JP1 | -GND | 1.22 1.26 | 5V | ISP / 2.10 | GND | 1.21 1.24 | 3.3V | GND | 1.23 0.11 | NC | RST | 0.2 / TXD | GND | 1.20 0.10 | GND | 0.3 / RXD | 5V | 3.3V | VUART | NC | 0.27 / 0.28 / 2.11 | SDA0 / SCL0 / INT | 0.26(ADC3) | 0.25(ADC2) | GND | 0.24(ADC1) | GND | B- 3.26 | G- 3.25 | R- 1.18 | BL+ | VOUT | RST 1.31 | NC | PSB | D7 2.7 | D6 2.6 | D5 2.5 | D4 2.4 | D3 2.3 | D2 2.2 | D1 2.1 | D0 2.0 | EN 1.27 | R/W 1.19 | RS 1.25 | VO | V+ | GND | 0.23(ADC0) | JP4 | UART | GLCD | JP3 | Nunchuck